# EAGLE design ROM_final_rev01 (EAGLE 9.6.0)
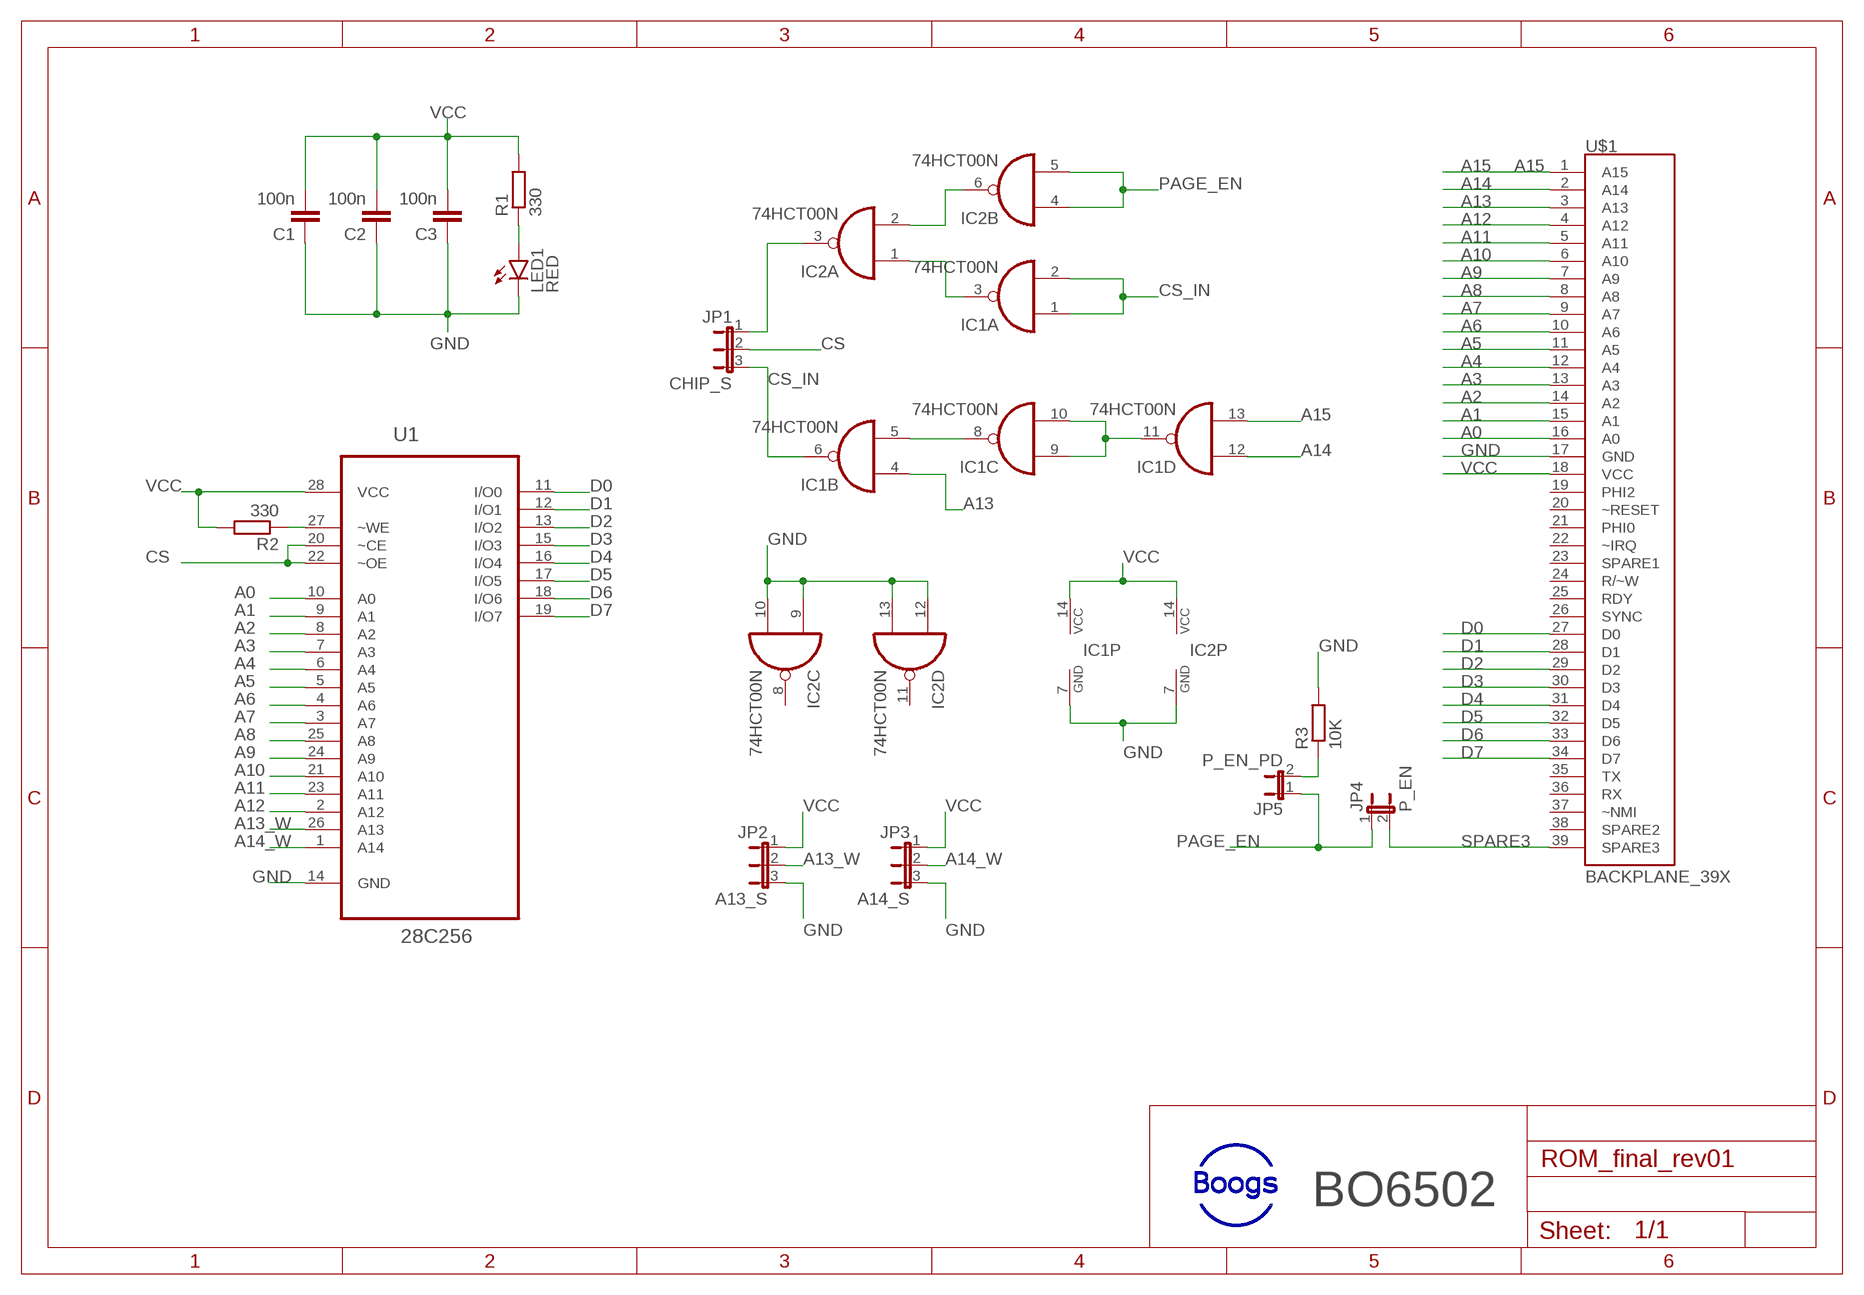
[diagram p0: schematic, sheet 1]

## Parts
C1  100n  C-EU025-025X050  [C025-025X050]
C2  100n  C-EU025-025X050  [C025-025X050]
C3  100n  C-EU025-025X050  [C025-025X050]
IC1  74HCT00N  [DIL14]
IC2  74HCT00N  [DIL14]
JP1  CHIP_S  JP2E  [JP2]
JP2  A13_S  JP2E  [JP2]
JP3  A14_S  JP2E  [JP2]
JP4  P_EN  JP1E  [JP1]
JP5  P_EN_PD  JP1E  [JP1]
LED1  RED  LED5MM  [LED5MM]
R1  330  R-EU_0207/10  [0207/10]
R2  330  R-EU_0207/10  [0207/10]
R3  10K  R-EU_0207/10  [0207/10]
U1  28C256  AT28C256-15PU  [DIP254P1524X482-28]
U$1  BACKPLANE_39X  [BP_39X]

## Nets
A0: U1.10(A0) U$1.16(A0)
A1: U1.9(A1) U$1.15(A1)
A2: U1.8(A2) U$1.14(A2)
A3: U1.7(A3) U$1.13(A3)
A4: U1.6(A4) U$1.12(A4)
A5: U1.5(A5) U$1.11(A5)
A6: U1.4(A6) U$1.10(A6)
A7: U1.3(A7) U$1.9(A7)
A8: U1.25(A8) U$1.8(A8)
A9: U1.24(A9) U$1.7(A9)
A10: U1.21(A10) U$1.6(A10)
A11: U1.23(A11) U$1.5(A11)
A12: U1.2(A12) U$1.4(A12)
A13: IC1.4(B:I0) U$1.3(A13)
A13_W: JP2.2 U1.26(A13)
A14: IC1.12(D:I0) U$1.2(A14)
A14_W: JP3.2 U1.1(A14)
A15: IC1.13(D:I1) U$1.1(A15)
CS: JP1.2 U1.20(~CE) U1.22(~OE)
CS_IN: IC1.1(A:I0) IC1.2(A:I1) IC1.6(B:O) JP1.3
D0: U1.11(I/O0) U$1.27(D0)
D1: U1.12(I/O1) U$1.28(D1)
D2: U1.13(I/O2) U$1.29(D2)
D3: U1.15(I/O3) U$1.30(D3)
D4: U1.16(I/O4) U$1.31(D4)
D5: U1.17(I/O5) U$1.32(D5)
D6: U1.18(I/O6) U$1.33(D6)
D7: U1.19(I/O7) U$1.34(D7)
GND: C1.1 C2.1 C3.1 IC1.7(P:GND) IC2.7(P:GND) IC2.9(C:I0) IC2.10(C:I1) IC2.12(D:I0) IC2.13(D:I1) JP2.3 JP3.3 LED1.K(C) R3.2 U1.14(GND) U$1.17(GND)
N$1: R2.1 U1.27(~WE)
N$2: IC2.2(A:I1) IC2.6(B:O)
N$3: IC1.3(A:O) IC2.1(A:I0)
N$4: IC2.3(A:O) JP1.1
N$5: IC1.5(B:I1) IC1.8(C:O)
N$6: LED1.A R1.1
N$7: IC1.9(C:I0) IC1.10(C:I1) IC1.11(D:O)
N$8: JP5.2 R3.1
PAGE_EN: IC2.4(B:I0) IC2.5(B:I1) JP4.1 JP5.1
SPARE3: JP4.2 U$1.39(SPARE3)
VCC: C1.2 C2.2 C3.2 IC1.14(P:VCC) IC2.14(P:VCC) JP2.1 JP3.1 R1.2 R2.2 U1.28(VCC) U$1.18(VCC)
Unconnected: IC2.8(C:O) IC2.11(D:O) U$1.19(PHI2) U$1.20(~RESET) U$1.21(PHI0) U$1.22(~IRQ) U$1.23(SPARE1) U$1.24(R/~W) U$1.25(RDY) U$1.26(SYNC) U$1.35(TX) U$1.36(RX) U$1.37(~NMI) U$1.38(SPARE2)

## Notes on the sheet
- BO6502

## Library data of the parts
C1-C3 = rcl:C-EU: CAPACITOR, European symbol; SPICEPREFIX: C
IC1 IC2 = 74xx-eu:74*00: Quad 2-input NAND gate
JP1-JP3 = jumper:JP2E: JUMPER
JP4 JP5 = jumper:JP1E: JUMPER
LED1 = led:LED: LED OSRAM: - CHIPLED LG R971, LG N971, LY N971, LG Q971, LY Q971, LO R971, LY R971 LH N974, LH R974 LS Q976, LO Q976, LY Q976 LO Q996 - Hyper CHIPLED LW Q18S LB Q993, LB Q99A, LB R99A - SideLED LS A670, LO A670, LY A670, LG A670, LP A670 LB A673, LV A673, LT A673, LW A673 LH A674 LY A675 LS A676, LA A676, LO A676, LY A676, LW A676 LS A679, LY A679, LG A679 - Hyper Micro SIDELED® LS Y876, LA Y876, LO Y876, LY Y876 LT Y87S - SmartLED LW L88C, LW L88S LB L89C, LB L89S, LG L890 LS L89K, LO L89K, LY L89K LS L896, LA L896, LO L896, LY L896 - TOPLED LS T670, LO T670, LY T670, LG T670, LP T670 LSG T670, LSP T670, LSY T670, LOP T670, LYG T670 LG T671, LOG T671, LSG T671 LB T673, LV T673, LT T673, LW T673 LH T674 LS T676, LA T676, LO T676, LY T676, LB T676, LH T676, LSB T676, LW T676 LB T67C, LV T67C, LT T67C, LS T67K, LO T67K, LY T67K, LW E67C LS E67B, LA E67B, LO E67B, LY E67B, LB E67C, LV E67C, LT E67C LW T67C LS T679, LY T679, LG T679 LS T770, LO T770, LY T770, LG T770, LP T770 LB T773, LV T773, LT T773, LW T773 LH T774 LS E675, LA E675, LY E675, LS T675 LS T776, LA T776, LO T776, LY T776, LB T776 LHGB T686 LT T68C, LB T68C - Hyper Mini TOPLED® LB M676 - Mini TOPLED Santana® LG M470 LS M47K, LO M47K, LY M47K Source: http://www.osram.convergy.de LUXEON: - LUMILED® LXK2-PW12-R00, LXK2-PW12-S00, LXK2-PW14-U00, LXK2-PW14-V00 LXK2-PM12-R00, LXK2-PM12-S00, LXK2-PM14-U00 LXK2-PE12-Q00, LXK2-PE12-R00, LXK2-PE12-S00, LXK2-PE14-T00, LXK2-PE14-U00 LXK2-PB12-K00, LXK2-PB12-L00, LXK2-PB12-M00, LXK2-PB14-N00, LXK2-PB14-P00, LXK2-PB14-Q00 LXK2-PR12-L00, LXK2-PR12-M00, LXK2-PR14-Q00, LXK2-PR14-R00 LXK2-PD12-Q00, LXK2-PD12-R00, LXK2-PD12-S00 LXK2-PH12-R00, LXK2-PH12-S00 LXK2-PL12-P00, LXK2-PL12-Q00, LXK2-PL12-R00 Source: www.luxeon.com KINGBRIGHT: KA-3528ASYC Source: www.kingbright.com
R1-R3 = rcl:R-EU_: RESISTOR, European symbol; SPICEPREFIX: R
U1 = AT28C256-15PU:AT28C256-15PU: Paged Parallel EEPROM Check availability <https://pricing.snapeda.com/parts/AT28C256-15PU/Microchip/view-part?ref=eda>; AVAILABILITY: In Stock; CHECK_PRICES: https://www.snapeda.com/parts/AT28C256-15PU/Microchip/view-part/?ref=eda; DESCRIPTION: EEPROM Memory IC 256Kb (32K x 8) Parallel 150 ns 28-PDIP; MF: Microchip; MP: AT28C256-15PU; PACKAGE: DIP-28 Microchip; PRICE: None; PURCHASE-URL: https://www.snapeda.com/api/url_track_click_mouser/?unipart_id=1769426&manufacturer=Microchip&part_name=AT28C256-15PU&search_term=None; SNAPEDA_LINK: https://www.snapeda.com/parts/AT28C256-15PU/Microchip/view-part/?ref=snap
U$1 = 65xx_family:BACKPLANE_39X; A15: A15

## Board
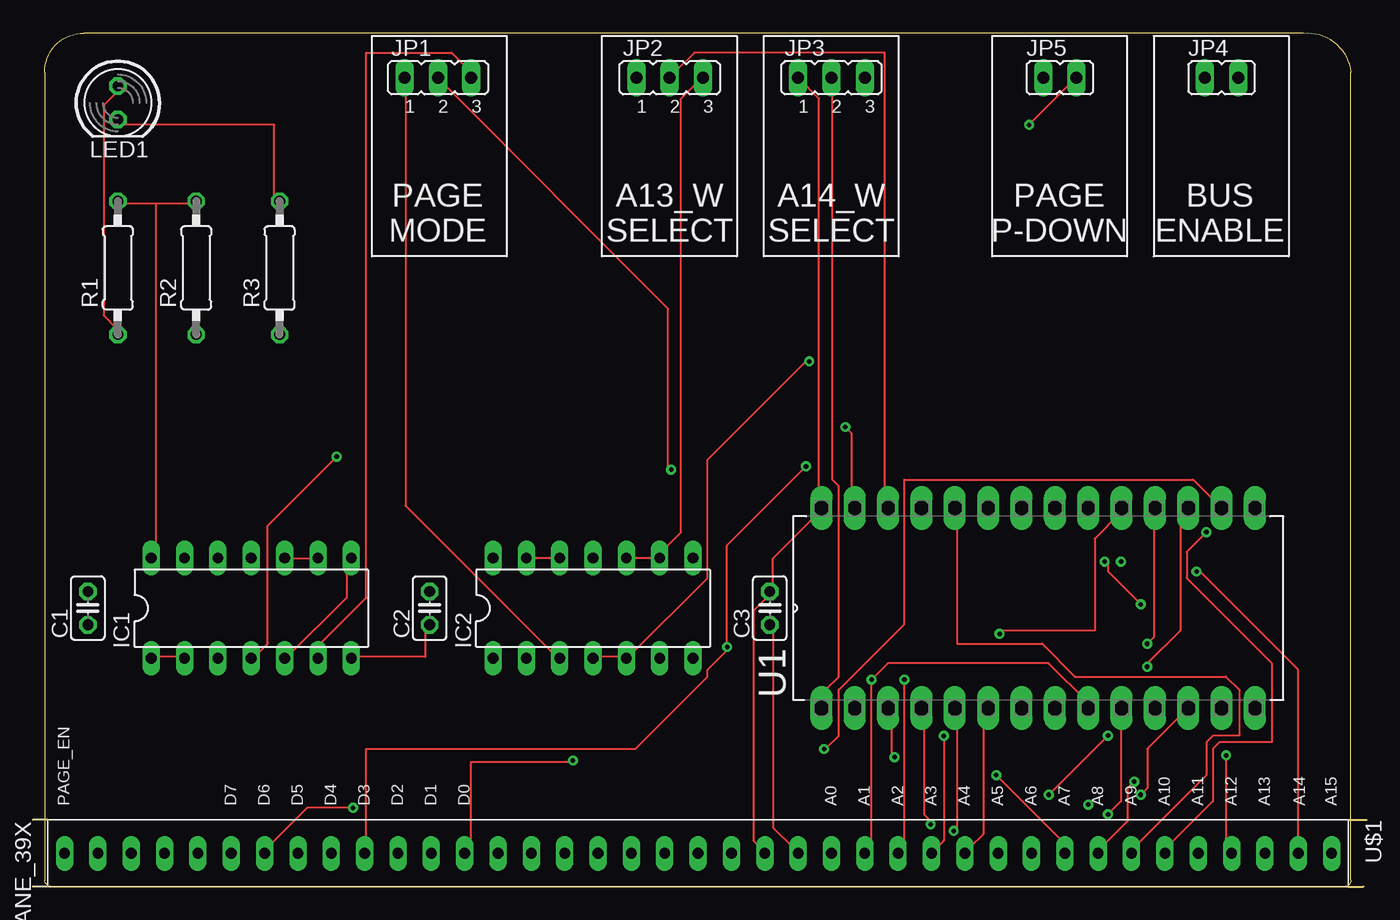
[diagram p1: board, top side]
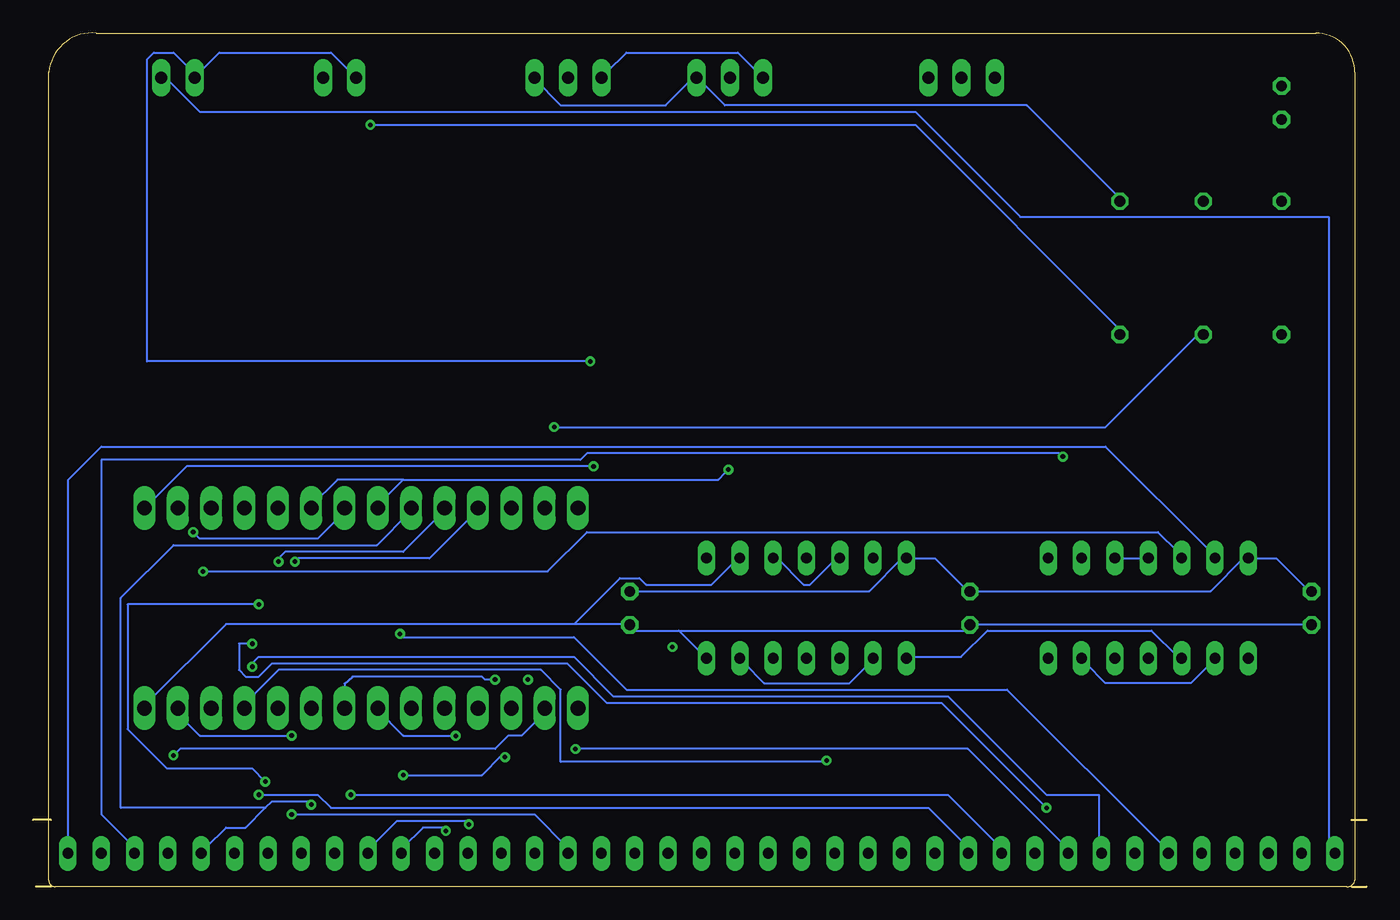
[diagram p2: board, bottom side, seen from below]

Size 101.6 x 65.02 mm. Coordinates in mm from the lower left corner, seen from the top.
Outline: 1.14,5.08 0,5.08
Outline: 1.14,0 0,0
Outline: 100.2,5.08 101.6,5.08
Outline: 100.2,0 101.35,0
Outline: 1.52,0 99.89,0 arc90 100.39,0.5 100.39,62 arc90 96.75,65 3.89,65 arc90 0.89,62 0.89,0.5 arc90 1.52,0
Copper layers (1*16): Top 0.035mm / dielectric 1.5mm / Bottom 0.035mm
Design rules "default *": minimum track width 6mil, minimum drill 0.35mm, track to track 10mil, track to pad 10mil, pad to pad 10mil, via to via 10mil, smd to smd 6mil, copper to edge 40mil, drill to drill 6mil, minimum pad ring 10mil, minimum via ring 8mil, stop-mask expansion 4mil, vias tented up to drill 15mil, thermal gap 10mil

### Footprints (pad centres in the part's own frame; a part is rotated, then mirrored left to right if it is on the bottom)
C025-025X050 = drill 0.813 octagon: 1 -1.27,0; 2 1.27,0
DIL14 = drill 0.813 long: 1 -7.62,-3.81; 2 -5.08,-3.81; 3 -2.54,-3.81; 4 0,-3.81; 5 2.54,-3.81; 6 5.08,-3.81; 7 7.62,-3.81; 8 7.62,3.81; 9 5.08,3.81; 10 2.54,3.81; 11 0,3.81; 12 -2.54,3.81; 13 -5.08,3.81; 14 -7.62,3.81
JP2 = drill 0.914 long: 1 -2.54,0; 2 0,0; 3 2.54,0
JP1 = drill 0.914 long: 1 0,-1.27; 2 0,1.27
LED5MM = drill 0.813 octagon: A -1.27,0; K 1.27,0
0207/10 = drill 0.813 octagon: 1 -5.08,0; 2 5.08,0
DIP254P1524X482-28 = drill 1.118 long: 1 -15.24,33.02; 2 -15.24,30.48; 3 -15.24,27.94; 4 -15.24,25.4; 5 -15.24,22.86; 6 -15.24,20.32; 7 -15.24,17.78; 8 -15.24,15.24; 9 -15.24,12.7; 10 -15.24,10.16; 11 -15.24,7.62; 12 -15.24,5.08; 13 -15.24,2.54; 14 -15.24,0; 15 0,0; 16 0,2.54; 17 0,5.08; 18 0,7.62; 19 0,10.16; 20 0,12.7; 21 0,15.24; 22 0,17.78; 23 0,20.32; 24 0,22.86; 25 0,25.4; 26 0,27.94; 27 0,30.48; 28 0,33.02
BP_39X = drill 0.813 long: 1 1.27,59.69; 2 1.27,57.15; 3 1.27,54.61; 4 1.27,52.07; 5 1.27,49.53; 6 1.27,46.99; 7 1.27,44.45; 8 1.27,41.91; 9 1.27,39.37; 10 1.27,36.83; 11 1.27,34.29; 12 1.27,31.75; 13 1.27,29.21; 14 1.27,26.67; 15 1.27,24.13; 16 1.27,21.59; 17 1.27,19.05; 18 1.27,16.51; 19 1.27,13.97; 20 1.27,11.43; 21 1.27,8.89; 22 1.27,6.35; 23 1.27,3.81; 24 1.27,1.27; 25 1.27,-1.27; 26 1.27,-3.81; 27 1.27,-6.35; 28 1.27,-8.89; 29 1.27,-11.43; 30 1.27,-13.97; 31 1.27,-16.51; 32 1.27,-19.05; 33 1.27,-21.59; 34 1.27,-24.13; 35 1.27,-26.67; 36 1.27,-29.21; 37 1.27,-31.75; 38 1.27,-34.29; 39 1.27,-36.83

### Placement (x,y rotation side)
C1  4.19,21.21 90 top
C2  30.23,21.21 90 top
C3  56.13,21.21 90 top
IC1  16.64,21.21 0 top
IC2  42.67,21.21 0 top
JP1  30.86,61.6 0 top
JP2  48.51,61.6 0 top
JP3  60.83,61.6 0 top
JP4  90.55,61.6 270 top
JP5  78.23,61.6 270 top
LED1  6.48,59.69 270 top
R1  6.48,47.12 90 top
R2  12.45,47.12 90 top
R3  18.8,47.12 90 top
U1  93.09,28.83 90 top
U$1  39.24,3.81 270 top

### Tracks (layer width: path | path; a pad name or v marks a point on that pad's centre or on a via)
A0  (via drill 0.35)
  Top 0.152: v81.89,5.5 82.89,6.5 82.89,13.5 U1.10
  Bottom 0.152: v81.89,5.5 63.39,5.5 60.89,3 U$1.16
A1  (via drill 0.35)
  Top 0.152: U$1.15 63.39,3 63.89,3.5 v63.89,15.77 65.13,17.02 77.37,17.02 80.39,14 U1.9
A2  (via drill 0.35)
  Top 0.152: v66.39,15.77 66.39,3 U$1.14
  Bottom 0.152: v66.39,15.77 67.16,15.77 67.39,16 77.25,16 77.85,15.47 U1.8
A3  (via drill 0.35)
  Top 0.152: U$1.13 68.89,3 69.39,3.5 69.39,11.5 v69.39,11.49
  Bottom 0.152: v69.39,11.49 69.39,11.5 73.39,11.5 75.39,13.5 U1.7
A4
  Top 0.152: U$1.12 71.39,3 72.39,4 72.39,13.5 U1.6
A5  (via drill 0.35)
  Top 0.152: v70.14,4.25 70.39,4.5 70.39,13.5 U1.5
  Bottom 0.152: U$1.11 73.39,3 71.89,4.5 70.39,4.5 v70.14,4.25
A6  (via drill 0.35)
  Top 0.152: v68.39,4.75 68.39,5 67.89,5.5 67.89,13.5 U1.4
  Bottom 0.152: U$1.10 75.89,3 73.89,5 68.39,5 v68.39,4.75
A7  (via drill 0.35)
  Top 0.152: v65.64,9.87 65.39,10 65.39,13.5 U1.3 | v73.39,8.5 78.39,3.5 78.39,3 U$1.9
  Bottom 0.152: v73.39,8.5 67.39,8.5 65.89,10 v65.64,9.87
A8  (via drill 0.35)
  Top 0.152: v83.89,8 83.39,7.5 83.39,5 81.39,3 U$1.8 | v84.39,21.5 81.89,24 81.89,24.5 v81.64,24.75
  Bottom 0.152: v81.64,24.75 81.39,25 71.39,25 67.89,28.5 U1.25 | v83.89,8 84.89,9 91.39,9 94.39,12 94.39,21.5 v84.39,21.5
A9  (via drill 0.35)
  Top 0.152: U$1.7 83.89,3 89.39,8.5 89.39,11 89.89,11.5 91.89,11.5 91.89,15 90.89,16 79.39,16 76.89,18.5 70.39,18.5 70.39,28.5 U1.24
  Bottom 0.152: v82.89,24.75 82.89,25 82.39,25.5 73.39,25.5 70.39,28.5 U1.24
A10  (via drill 0.35)
  Top 0.152: v89.39,27 87.89,25.5 87.89,23.5 94.39,17 94.39,11 90.39,11 89.89,10.5 89.89,6.5 86.39,3 U$1.6
  Bottom 0.152: v89.39,27 88.89,26.5 79.89,26.5 77.89,28.5 U1.21
A11  (via drill 0.35)
  Bottom 0.152: 83.89,6 85.39,4.5 86.89,4.5 88.39,3 U$1.5 | 83.89,6 83.39,6.5 80.39,6.5 v80.39,6.25 | 83.89,6 94.89,6 94.89,22 90.89,26 75.39,26 72.89,28.5 U1.23
A12  (via drill 0.35)
  Top 0.152: v90.89,10 90.89,3 U$1.4
  Bottom 0.152: v90.89,10 90.39,10.5 66.39,10.5 65.39,11.5 64.39,11.5 62.39,13.5 U1.2
A13  (via drill 0.35)
  Top 0.152: v23.14,32.75 17.89,27.5 17.89,18.5 16.89,17.5 IC1.4
  Bottom 0.152: U$1.3 93.89,3 96.39,5.5 96.39,32.5 59.89,32.5 59.39,33 23.39,33 v23.14,32.75
A13_W
  Top 0.152: JP2.2 48.89,62 50.39,63.5 64.89,63.5 64.89,29 U1.26
A14  (via drill 0.35)
  Top 0.152: v88.64,24 88.89,24 96.39,16.5 96.39,3 U$1.2
  Bottom 0.152: v88.64,24 62.39,24 59.39,27 15.89,27 14.39,25.5 IC1.12
A14_W
  Top 0.152: JP3.2 60.89,61.5 60.89,31 61.39,30.5 61.39,16 60.39,15 60.39,14 U1.1
A15
  Bottom 0.152: IC1.13 11.89,25.5 19.89,33.5 96.39,33.5 98.89,31 98.89,3 U$1.1
CS  (via drill 0.35)
  Top 0.152: JP1.2 30.89,61.5 48.39,44 48.39,32 v48.63,31.76
  Bottom 0.152: 73.39,31 49.39,31 48.89,31.5 v48.63,31.76 | 73.39,31 75.39,29 U1.22 | 73.39,31 78.39,31 80.39,29 U1.20
CS_IN
  Top 0.152: IC1.1 9.39,17.5 11.39,17.5 IC1.2 | JP1.3 33.39,62 31.89,63.5 25.39,63.5 25.39,22 21.89,18.5 21.89,17.5 IC1.6
  Bottom 0.152: IC1.6 21.39,17 19.89,15.5 13.39,15.5 11.89,17 IC1.2
D0  (via drill 0.35)
  Top 0.152: v41.14,9.61 40.89,9.5 33.39,9.5 33.39,3 U$1.27
  Bottom 0.152: U1.11 85.39,14 82.89,16.5 62.89,16.5 61.39,15 61.39,9.5 41.39,9.5 v41.14,9.61
D1  (via drill 0.35)
  Top 0.152: v84.39,7 84.89,7.5 84.89,10.5 87.89,13.5 U1.12
  Bottom 0.152: v84.39,7 79.89,7 78.89,6 33.39,6 30.39,3 U$1.28
D2  (via drill 0.35)
  Top 0.152: v81.89,11.5 v77.39,7
  Bottom 0.152: v77.39,7 31.89,7 27.89,3 U$1.29 | v81.89,11.5 88.89,11.5 90.89,13.5 U1.13
D3  (via drill 0.35)
  Top 0.152: U$1.30 25.39,3 25.39,10.5 45.89,10.5 51.39,16 51.39,16.5 52.89,18 v52.89,18.25 52.89,26 v58.89,32
  Bottom 0.152: v58.89,32 89.89,32 92.89,29 U1.15
D4  (via drill 0.35)
  Top 0.152: U1.16 90.39,29 88.39,31 66.39,31 66.39,20 61.39,15 61.39,11.5 60.39,10.5 v60.27,10.49
  Bottom 0.152: v60.27,10.49 59.89,10.5 30.39,10.5 22.89,3 U$1.31
D5  (via drill 0.35)
  Top 0.152: v84.89,16.75 84.89,17 87.39,19.5 87.39,28 87.89,28.5 U1.17
  Bottom 0.152: U$1.32 20.39,3 20.39,7 24.39,7 31.89,14.5 57.39,14.5 60.39,17.5 84.39,17.5 84.89,17 v84.89,16.75
D6  (via drill 0.35)
  Top 0.152: v84.89,18.5 85.39,19 85.39,28.5 U1.18 | v24.39,6 20.89,6 17.89,3 U$1.33
  Bottom 0.152: v24.39,6 32.39,14 57.89,14 60.89,17 83.39,17 84.39,16 85.39,16 85.89,16.5 85.89,18.5 v84.89,18.5
D7  (via drill 0.35)
  Top 0.152: v73.64,19.25 73.89,19.5 80.89,19.5 80.89,26.5 82.89,28.5 U1.19
  Bottom 0.152: U$1.34 15.39,3 27.39,15 56.39,15 60.39,19 73.39,19 v73.64,19.25
GND
  Top 0.152: LED1.K 6.89,58 18.39,58 18.39,52.5 R3.2 | IC1.7 24.39,17.5 29.89,17.5 29.89,19.5 C2.1 | IC2.13 37.89,25 39.89,25 IC2.12 | IC2.10 45.39,25 47.39,25 IC2.9 47.89,25.5 49.39,27 49.39,60 50.89,61.5 JP2.3 | U$1.17 57.89,3 56.39,4.5 56.39,19.5 C3.1
  Bottom 0.152: JP3.3 63.39,61.5 61.39,59.5 53.39,59.5 51.39,61.5 JP2.3 50.89,61.5 48.89,59.5 25.89,59.5 18.89,52.5 R3.2 | C1.1 4.39,20 29.89,20 C2.1 30.39,19.5 52.39,19.5 | IC2.12 40.39,25 42.39,23 42.89,23 44.89,25 IC2.10 | 52.39,19.5 50.39,17.5 IC2.7 | 52.39,19.5 55.89,19.5 C3.1 56.39,20 60.39,20 | 60.39,20 86.89,20 92.89,14 U1.14 | 60.39,20 56.89,23.5 55.39,23.5 54.89,23 49.89,23 47.89,25 IC2.9
N$1  (via drill 0.35)
  Top 0.152: v61.89,35 62.39,34.5 62.39,29 U1.27
  Bottom 0.152: 12.64,42 R2.1 12.89,42 19.89,35 v61.89,35
N$2
  Bottom 0.152: IC2.2 37.89,17 39.39,15.5 45.89,15.5 47.39,17 IC2.6
N$3
  Bottom 0.152: IC1.3 14.39,17.5 16.39,19.5 28.89,19.5 30.89,17.5 34.89,17.5 IC2.1
N$4
  Top 0.152: IC2.3 39.89,17.5 28.39,29 28.39,61.5 JP1.1
N$5
  Top 0.152: IC1.5 19.39,17.5 23.89,22 23.89,25 IC1.8
N$6
  Top 0.152: R1.1 6.39,42.5 5.39,43.5 5.39,59.5 6.39,60.5 LED1.A
N$7
  Top 0.152: IC1.9 21.39,25 19.39,25 IC1.10
  Bottom 0.152: IC1.11 16.89,25 18.89,25 IC1.10
N$8  (via drill 0.35)
  Top 0.152: v75.89,58 79.39,61.5 JP5.2
  Bottom 0.152: 18.89,42.25 R3.1 18.89,42.5 34.39,58 v75.89,58
PAGE_EN  (via drill 0.35)
  Top 0.152: v59.14,40 58.89,40 51.39,32.5 51.39,23.5 45.39,17.5 IC2.5 44.89,17.5 42.89,17.5 IC2.4
  Bottom 0.152: JP5.1 77.39,62 78.89,63.5 87.39,63.5 88.89,62 JP4.1 89.39,62 90.89,63.5 92.39,63.5 92.89,63 92.89,40 v59.14,40
SPARE3
  Bottom 0.152: U$1.39 2.89,3 2.89,51 26.39,51 34.39,59 88.89,59 91.39,61.5 JP4.2
VCC
  Top 0.152: 9.39,52 12.39,52 R2.2 | 9.39,52 6.89,52 R1.2 | 9.39,52 9.39,25.5 IC1.14 | U$1.18 55.39,3 54.89,3.5 54.89,21 55.89,22 C3.2 56.39,22.5 56.39,25 59.89,28.5 U1.28 59.89,29 59.89,60 58.39,61.5 JP3.1
  Bottom 0.152: C1.2 4.39,22.5 6.89,25 8.89,25 IC1.14 9.39,25 11.89,22.5 29.89,22.5 C2.2 30.39,22.5 32.89,25 34.89,25 IC2.14 35.39,25 37.89,22.5 55.89,22.5 C3.2 | JP2.1 46.39,62 47.89,63.5 56.39,63.5 57.89,62 JP3.1

### Text on the board
tNames: PAGE / MODE | A13_W / SELECT | A14_W / SELECT | PAGE / P-DOWN | BUS / ENABLE | PAGE_EN | D7 | D6 | D5 | D4 | D3 | D2 | D1 | D0 | A0 | A1 | A2 | A3 | A4 | A5 | A6 | A7 | A8 | A9 | A10 | A11 | A12 | A13 | A14 | A15